# Altium schematic sheet ModuLoop_V1.SchDoc
size 241 x 190 mm; SheetNumber: 1; SheetTotal: 1
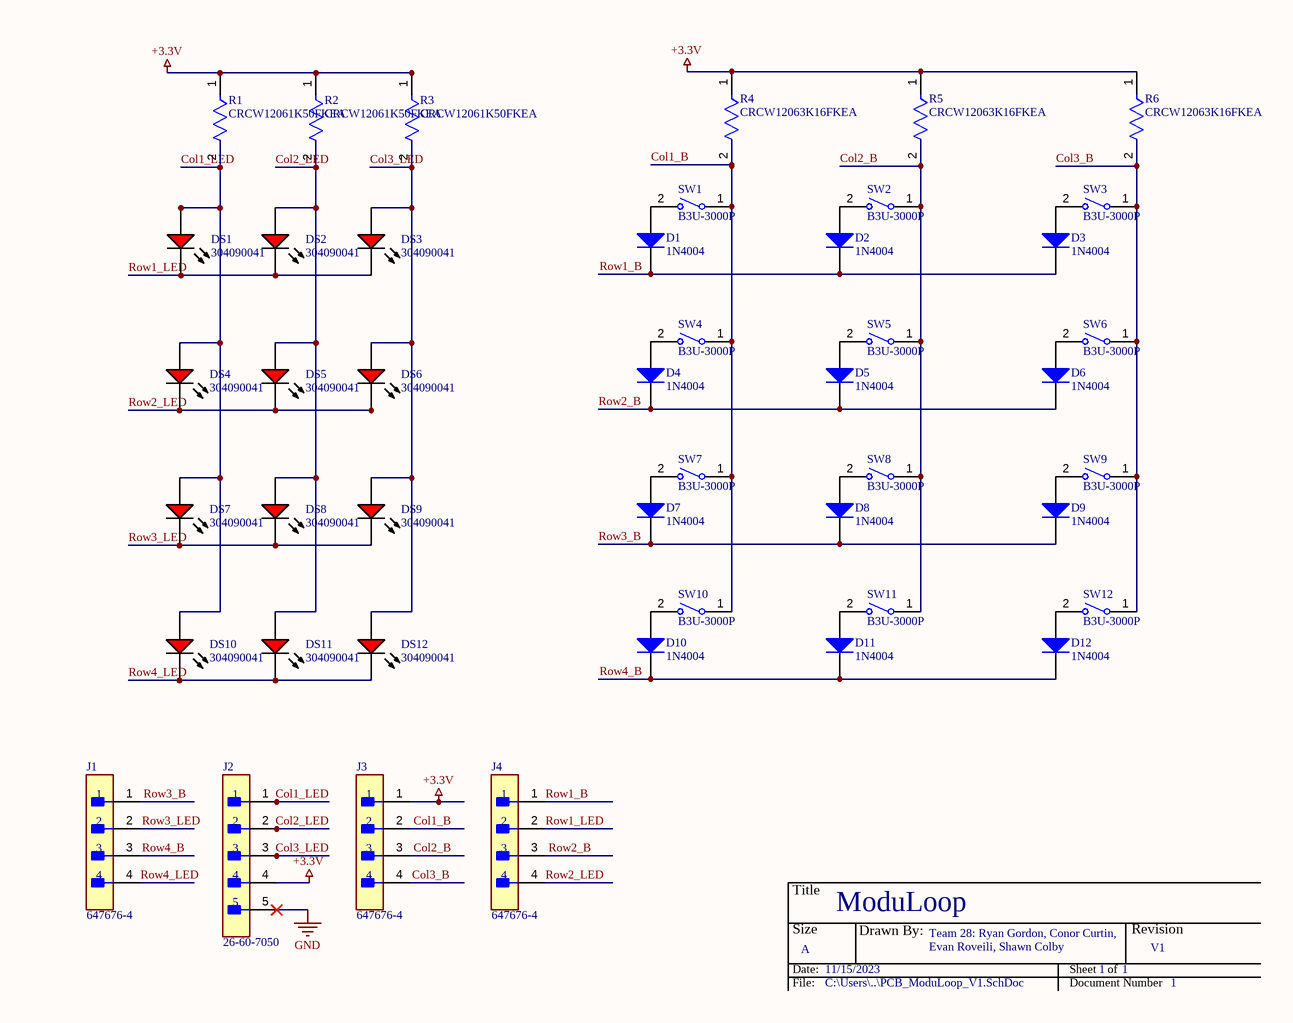
[diagram p0: ModuLoop_V1.SchDoc]

## Parts
D1  1N4004  [FAIR-DO-41-2]
D2  1N4004  [FAIR-DO-41-2]
D3  1N4004  [FAIR-DO-41-2]
D4  1N4004  [FAIR-DO-41-2]
D5  1N4004  [FAIR-DO-41-2]
D6  1N4004  [FAIR-DO-41-2]
D7  1N4004  [FAIR-DO-41-2]
D8  1N4004  [FAIR-DO-41-2]
D9  1N4004  [FAIR-DO-41-2]
D10  1N4004  [FAIR-DO-41-2]
D11  1N4004  [FAIR-DO-41-2]
D12  1N4004  [FAIR-DO-41-2]
DS1  304090041  [LED-2P-2.28-3MM_A]
DS2  304090041  [LED-2P-2.28-3MM_A]
DS3  304090041  [LED-2P-2.28-3MM_A]
DS4  304090041  [LED-2P-2.28-3MM_A]
DS5  304090041  [LED-2P-2.28-3MM_A]
DS6  304090041  [LED-2P-2.28-3MM_A]
DS7  304090041  [LED-2P-2.28-3MM_A]
DS8  304090041  [LED-2P-2.28-3MM_A]
DS9  304090041  [LED-2P-2.28-3MM_A]
DS10  304090041  [LED-2P-2.28-3MM_A]
DS11  304090041  [LED-2P-2.28-3MM_A]
DS12  304090041  [LED-2P-2.28-3MM_A]
J1  647676-4  [FP-647676-4-MFG]
J2  26-60-7050  [FP-26-60-7050-0]
J3  647676-4  [FP-647676-4-MFG]
J4  647676-4  [FP-647676-4-MFG]
R1  CRCW12061K50FKEA  [FP-CRCW1206-e3-IPC_C]
R2  CRCW12061K50FKEA  [FP-CRCW1206-e3-IPC_C]
R3  CRCW12061K50FKEA  [FP-CRCW1206-e3-IPC_C]
R4  CRCW12063K16FKEA  [FP-CRCW1206-e3-MFG]
R5  CRCW12063K16FKEA  [FP-CRCW1206-e3-MFG]
R6  CRCW12063K16FKEA  [FP-CRCW1206-e3-MFG]
SW1  B3U-3000P  [OMRON-B3U-3000P_V]
SW2  B3U-3000P  [OMRON-B3U-3000P_V]
SW3  B3U-3000P  [OMRON-B3U-3000P_V]
SW4  B3U-3000P  [OMRON-B3U-3000P_V]
SW5  B3U-3000P  [OMRON-B3U-3000P_V]
SW6  B3U-3000P  [OMRON-B3U-3000P_V]
SW7  B3U-3000P  [OMRON-B3U-3000P_V]
SW8  B3U-3000P  [OMRON-B3U-3000P_V]
SW9  B3U-3000P  [OMRON-B3U-3000P_V]
SW10  B3U-3000P  [OMRON-B3U-3000P_V]
SW11  B3U-3000P  [OMRON-B3U-3000P_V]
SW12  B3U-3000P  [OMRON-B3U-3000P_V]

## Nets
+3.3V: J2.4 J3.1 R1.1 R2.1 R3.1 R4.1 R5.1 R6.1
GND: J2.5
Col1_B: J3.2 R4.2 SW1.1 SW4.1 SW7.1 SW10.1
Col1_LED: DS1.1(A) DS4.1(A) DS7.1(A) DS10.1(A) J2.1 R1.2
Col2_B: J3.3 R5.2 SW2.1 SW5.1 SW8.1 SW11.1
Col2_LED: DS2.1(A) DS5.1(A) DS8.1(A) DS11.1(A) J2.2 R2.2
Col3_B: J3.4 R6.2 SW3.1 SW6.1 SW9.1 SW12.1
Col3_LED: DS3.1(A) DS6.1(A) DS9.1(A) DS12.1(A) J2.3 R3.2
Row1_B: D1.2(K) D2.2(K) D3.2(K) J4.1
Row1_LED: DS1.2(K) DS2.2(K) DS3.2(K) J4.2
Row2_B: D4.2(K) D5.2(K) D6.2(K) J4.3
Row2_LED: DS4.2(K) DS5.2(K) DS6.2(K) J4.4
Row3_B: D7.2(K) D8.2(K) D9.2(K) J1.1
Row3_LED: DS7.2(K) DS8.2(K) DS9.2(K) J1.2
Row4_B: D10.2(K) D11.2(K) D12.2(K) J1.3
Row4_LED: DS10.2(K) DS11.2(K) DS12.2(K) J1.4
NetD1_1: D1.1(A) SW1.2
NetD2_1: D2.1(A) SW2.2
NetD3_1: D3.1(A) SW3.2
NetD4_1: D4.1(A) SW4.2
NetD5_1: D5.1(A) SW5.2
NetD6_1: D6.1(A) SW6.2
NetD7_1: D7.1(A) SW7.2
NetD8_1: D8.1(A) SW8.2
NetD9_1: D9.1(A) SW9.2
NetD10_1: D10.1(A) SW10.2
NetD11_1: D11.1(A) SW11.2
NetD12_1: D12.1(A) SW12.2

## Notes on the sheet
- Title
- Size
- Date:
- A
- 11/15/2023
- ModuLoop
- Drawn By:
- Team 28: Ryan Gordon, Conor Curtin, Evan Roveili, Shawn Colby
- Sheet
- 1
- of
- Revision
- V1
- File:
- C:\Users\..\PCB_ModuLoop_V1.SchDoc
- Document Number

## Library data of the parts
D1-D12 = CMP-004-00004-2: General Purpose Rectifier, 400 V, 1 A, -55 to 175 degC, 2-Pin DO-204AL (DO-41), RoHS, Tape and Reel; Manufacturer: Fairchild Semiconductor; Forward Voltage: 1.1V; Forward Current: 1A; Max Surge Current: 30A; Package Version: Rev. 2, 09/2008; Peak Reverse Current: 50A; Case/Package: DO-41-2; Pins: 2; RoHS Compliant: True; Diameter: 2.72mm; Package Reference: DO-41-2; Datasheet URL: https://www.fairchildsemi.com/datasheets/1N/1N4004.pdf; Manufacturer URL: https://www.fairchildsemi.com/; Max Operating Temperature: 175°C; Datasheet Version: Rev. 1.1.0, 11/2014; Package URL: http://www.fairchildsemi.com/dwg/DO/DO41A.pdf; Package Quantity: 5000; Min Operating Temperature: -55°C; Package Description: 2-Pin Axial Lead, Dia 2.375 mm, Body Length 4.63 mm; Mounting Technology: TH; Packaging: TapeandReel
DS1-DS12 = CMP-007-00007-2: Red LED, 80 mW, 30 mA, -25 to 85 degC, 2-Pin THD; Manufacturer: Shenzhen CGX; Package Description: 2-Pin Through Hole Device, Dia 3 mm, Pitch 2.28 mm; Datasheet URL: http://datasheet.octopart.com/304090041-Chengguangxing-datasheet-62330656.pdf; Mounting Technology: TH; Manufacturer URL: http://szcgx.com/; RoHS Compliant: Unknown; Datasheet Version: Sep-14; Case/Package: 304090041; Package Reference: 304090041
J1 J3 J4 = CMP-03369-000065-1: CONN HEADER R/A 4POS 3.96MM; Manufacturer: TE; Conn Gender: Male; Voltage Rating: 250V; Current Rating: 7.5A; Conn Orientation: Right Angle; Number Of Contacts: 4; Temperature: -25°C to +105°C; Temperature Range High: +105°C; ComponentLink2URL: https://www.te.com/commerce/DocumentDelivery/DDEController?Action=showdoc&DocId=Specification+Or+Standard%7F108-2297%7FB%7Fpdf%7FEnglish%7FENG_SS_108-2297_B_108-2297RevB.pdf%7F647676-6; Footprint Url: https://www.te.com/commerce/DocumentDelivery/DDEController?Action=showdoc&DocId=Customer+Drawing%7F647676%7FB1%7Fpdf%7FEnglish%7FENG_CD_647676_B1.pdf%7F647676-6; ComponentLink2Description: Datasheet; Number Of Rows: 1; Automotive: No; Lead Free: Yes; Device Class L3: unset; Manufacturer Part Number: 647676-4; Category: Conn; Contact Material: Tin; Device Class L1: Connectors; Height: 8.8mm; Mouser Description: 4 Position Single Row 3.96 mm Right Angle Header Unshrouded Male Pin Connector; Pitch: 3.96mm; Package: 647676-4; Octopart: https://octopart.com/647676-4-te+connectivity-41901901; RoHS: TRUE; Device Class L2: Headers and Wire Housings; Digikey Description: CONN HEADER R/A 4POS 3.96MM; Temperature Range Low: -25°C
J2 = CMP-04776-000795-1: CONN HEADER R/A 5POS 3.96MM; Voltage Rating: 250V; Number of Contacts: 5; Gender: Male; Current Rating: 7A; Series: 42892; Packaging: Bag; Min Operating Temperature: 0°C; Number of Rows: 1; Termination: Solder; Housing Material: Polyester; Contact Plating: Tin; Depth: 3.3mm; Radiation Hardening: No; Length: 19.66mm; Orientation: Right Angle; Package Quantity: 300; Pitch: 3.96mm; Contact Material: Brass; Number of Positions: 5; Max Operating Temperature: 75°C; RoHS Compliant: Yes
R1-R3 = CMP-02407-002229-1: RES Thick Film, 1.5kΩ, 1%, 0.25W, 100ppm/°C, 1206; Voltage Rating (DC): 200V; Power Rating: 250mW; Resistance: 1.5kR; Depth: 1.6mm; Case/Package: 1206; Packaging: Tape and Reel; Military Standard: Not; Radiation Hardening: No; Features: Automotive AEC-Q200; Number of Terminations: 2; Case Code (Imperial): 1206; Width: 0.063inch; Voltage Rating: 200V; Tolerance: 1%; Max Operating Temperature: 155°C; Weight: 0.000353oz; Package Quantity: 10; Temperature Coefficient: 100ppm/°C; Lead Free: Lead Free; Height: 0.024inch; Max Power Dissipation: 250mW; Termination: SMD/SMT; Length: 3.2mm; Contact Plating: Tin; Composition: Thick Film; Min Operating Temperature: -55°C; Case Code (Metric): 3216
R4-R6 = CMP-2003-02148-2: RES Thick Film, 3.16kΩ, 1%, 0.25W, 100ppm/°C, 1206; Max Power Dissipation: 250mW; Working Voltage: 200V; Resistance: 3.16kR; Depth: 1.6mm; Tolerance: 1%; Height: 0.55mm; Lead Free: Lead Free; Features: Automotive AEC-Q200; Mount: Surface Mount; Max Operating Temperature: 155°C; Min Operating Temperature: -55°C; Temperature Coefficient: 100ppm/°C; Case Code (Imperial): 1206; Military Standard: Not; Length: 3.2mm; Composition: Thick Film; Contact Plating: Tin; Case Code (Metric): 3216; Weight: 0.000353oz; Case/Package: 1206; Voltage Rating (DC): 200V; Voltage Rating: 200V; Power Rating: 250mW; Termination: SMD/SMT; Radiation Hardening: No; Package Quantity: 10; Width: 1.6mm; Number of Terminations: 2; Packaging: Tape and Reel; Number of Pins: 2
SW1-SW12 = CMP-011-00005-2: Tactile Switch, SPST-NO, 0.05 A, 12 V, -25 to 70 degC, 2-Pin SMD, RoHS, Tape and Reel; Manufacturer: Omron Electronic Components; Operating Force: 162gf; Voltage Rating (DC): 12V; Current Rating: 50mA; IP Rating: IP40; Throw Configuration: SPST; Max Contact Resistance: 100mohm; RoHS Compliant: True; Contact Current Rating: 50mA; Manufacturer URL: http://www.omron.com/; Packaging: TapeandReel; Max Voltage Rating (DC): 12V; Contact Material: Silver; Datasheet Version: Jan-15; Package Reference: B3U-3000P; Package Description: 2-Pin Surface Mount Device, Body 4 x 3.2 mm; Min Operating Temperature: -25°C; Package Quantity: 4000; Max Operating Temperature: 70°C; Max Current Rating: 50mA; Voltage Rating: 12V; Case/Package: B3U-3000P; Mounting Technology: SM; Datasheet URL: https://www.omron.com/ecb/products/pdf/en-b3u.pdf